# Altium schematic sheet CAN0.SchDoc: foxBMS BMS-Master
size A3; DocumentNumber: 14; SheetNumber: 14; SheetTotal: 24; Author: Fraunhofer IISB foxBMS Team; REL-DATE: 2017-05-16; VERSION: 1.0.6; SheetDescription: CAN0 Interface for MCU0; Rule: UNIONINDEX=0|RULEKIND=Clearance|NETSCOPE=DifferentNets|LAYERKIND=SameLayer|NAME=Schematic Clearance Constraint|GAP=10mil|GENERICCLEARANCE=10mil|IGNOREPADTOPADCLEARANCEINFOOTPRINT=FALSE|OBJECTCLEARANCES=ClearanceObj_Arc-ClearanceObj_Hole:0;ClearanceObj_Track-ClearanceObj_Hole:0;ClearanceObj_SMDPad-ClearanceObj_Hole:0;ClearanceObj_THPad-ClearanceObj_Hole:0;ClearanceObj_Via-ClearanceObj_Hole:0;ClearanceObj_Fill-ClearanceObj_Hole:0;ClearanceObj_Poly-ClearanceObj_Hole:0;ClearanceObj_Region-ClearanceObj_Hole:0;ClearanceObj_Text-ClearanceObj_Hole:0|UNIT=Metric
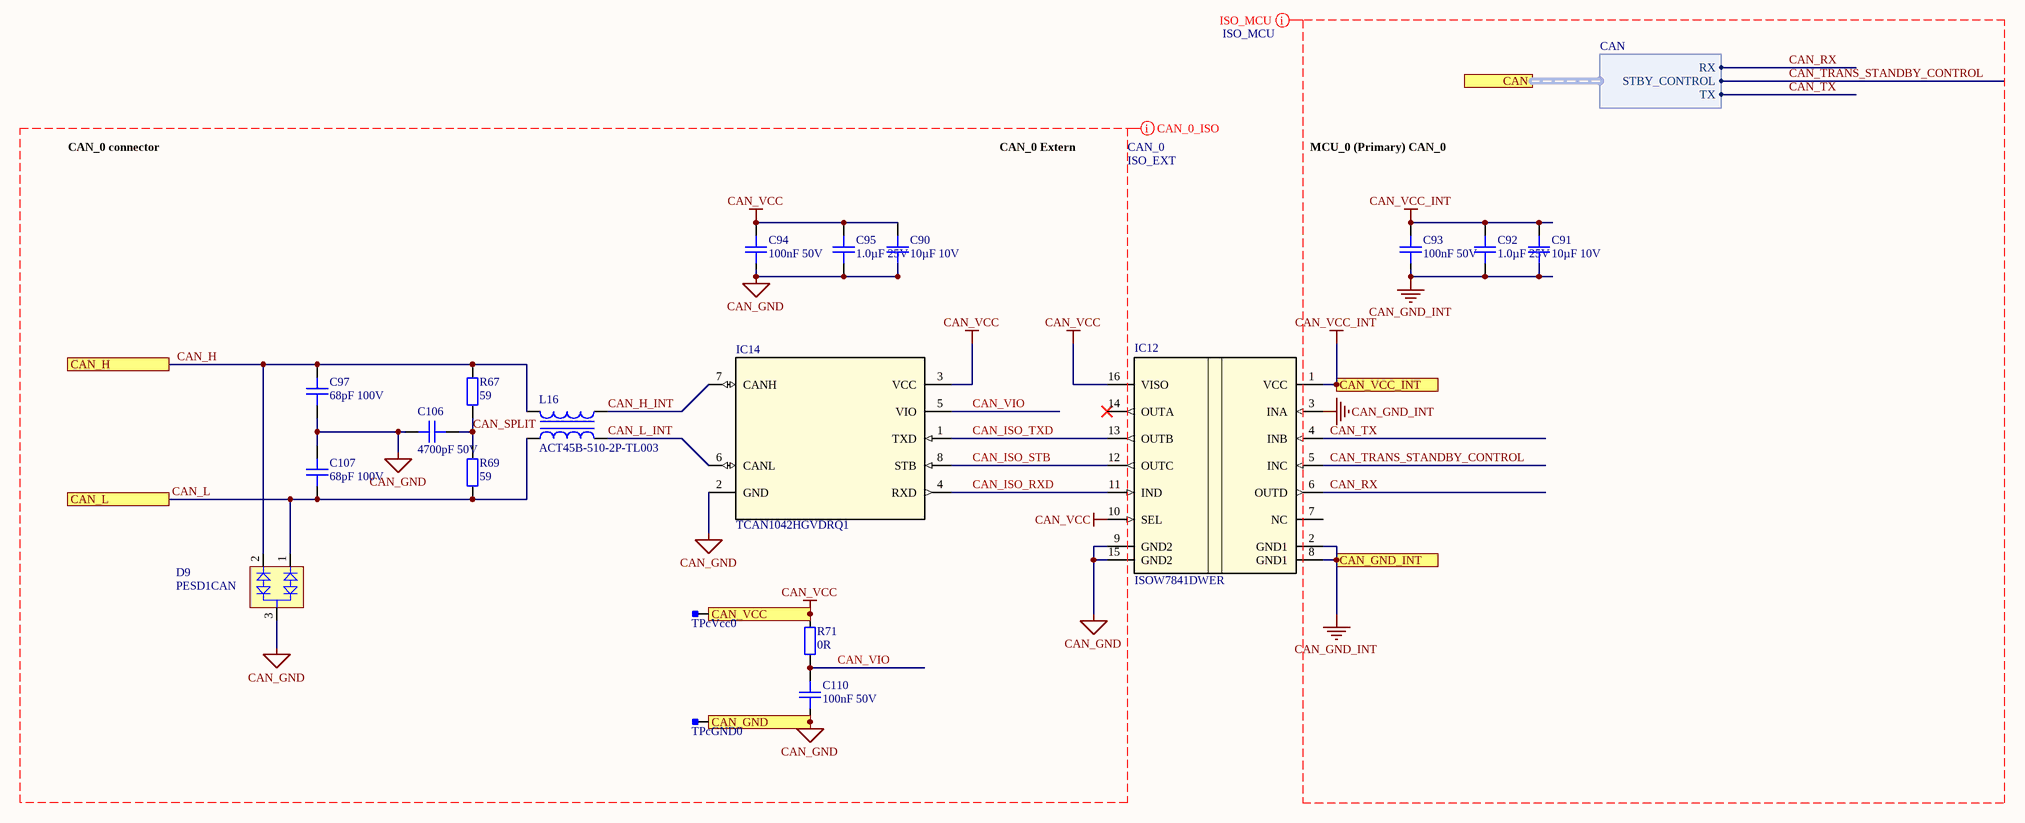
[diagram p0: CAN0.SchDoc]

## Parts
C90  10µF 10V  [0805C]
C91  10µF 10V  [0805C]
C92  1.0µF 25V  [0603C]
C93  100nF 50V  [0603C]
C94  100nF 50V  [0603C]
C95  1.0µF 25V  [0603C]
C97  68pF 100V  [0603C]
C106  4700pF 50V  [0603C]
C107  68pF 100V  [0603C]
C110  100nF 50V  [0603C]
D9  PESD1CAN  [NXP-SOT23-3_V]
IC12  ISOW7841DWER  [DWE0016A]
IC14  TCAN1042HGVDRQ1  [D0008A_N]
L16  ACT45B-510-2P-TL003  [TDK-ACT45B-510-2P-TL003-4_V]
R67  59  [0805R]
R69  59  [0805R]
R71  0R  [0603R]
TPcGND0  Testpoint_Square  [Testpoint_S1]  (value not drawn)  (no BOM)
TPcVcc0  Testpoint_Square  [Testpoint_S1]  (value not drawn)  (no BOM)

## Ports
CAN (harness CAN), CAN_GND, CAN_GND_INT, CAN_H, CAN_L, CAN_VCC, CAN_VCC_INT

## Harnesses
CAN: RX, STBY_CONTROL, TX

## Nets
CAN_GND: C90.2 C94.1 C95.1 C97.1 C106.1 C107.2 C110.1 D9.3(C) IC12.9(GND2) IC12.15(GND2) IC14.2(GND) TPcGND0.1 ; port CAN_GND
CAN_GND_INT: C91.2 C92.1 C93.1 IC12.2(GND1) IC12.3(INA) IC12.8(GND1) ; port CAN_GND_INT
CAN_VCC: C90.1 C94.2 C95.2 IC12.10(SEL) IC12.16(VISO) IC14.3(VCC) R71.1 TPcVcc0.1 ; port CAN_VCC
CAN_VCC_INT: C91.1 C92.2 C93.2 IC12.1(VCC) ; port CAN_VCC_INT
CAN_H: C97.2 D9.2(K2) L16.2 R67.2 ; port CAN_H
CAN_H_INT: IC14.7(CANH) L16.3
CAN_ISO_RXD: IC12.11(IND) IC14.4(RXD)
CAN_ISO_STB: IC12.12(OUTC) IC14.8(STB)
CAN_ISO_TXD: IC12.13(OUTB) IC14.1(TXD)
CAN_L: C107.1 D9.1(K1) L16.1 R69.1 ; port CAN_L
CAN_L_INT: IC14.6(CANL) L16.4
CAN_RX: IC12.6(OUTD) ; port CAN.RX
CAN_SPLIT: C106.2 R67.1 R69.2
CAN_TRANS_STANDBY_CONTROL: IC12.5(INC) ; port CAN.STBY_CONTROL
CAN_TX: IC12.4(INB) ; port CAN.TX
CAN_VIO: C110.2 IC14.5(VIO) R71.2

Not connected (* = marked no-connect by the designer): IC12 7(NC) 14(OUTA)*

## Layout directives
net class CAN_0; net class ISO_EXT: CAN_GND, CAN_H, CAN_H_INT, CAN_ISO_RXD, CAN_ISO_STB, CAN_ISO_TXD, CAN_L, CAN_L_INT, CAN_SPLIT, CAN_VCC, CAN_VIO
net class ISO_MCU: CAN_GND_INT, CAN_RX, CAN_TRANS_STANDBY_CONTROL, CAN_TX, CAN_VCC_INT

## Notes on the sheet
- CAN_0 connector
- CAN_0 Extern
- MCU_0 (Primary) CAN_0
- Fraunhofer IISB
- Schottkystr. 10
- developed by:
- 91058 Erlangen
- Germany
- Author
- Project
- License
- Description
- File
- Version
- Release Date
- Sheet
- www.foxbms.org
- www.iisb.fraunhofer.de
- foxBMS Team
- /

## Library data of the parts
C90 C91 = gen_C_ceramic_10u_10V_X7R_0805: Ceramic, 10µF, ±10%, 10V, X7R, –55 to 125°C, 0805 (2012),RoHS, Automotive; Part Number: GCJ21BR71A106KE01; Manufacturer: Murata; Case EIA: 0805; Case Metric: 2012; Automotive Qualified: True; PnP Package: C_0805_10; PnP Value: 10µF/10V/X7R; Capacitance: 10µF; Rated Voltage: 10V; Dielectric: X7R; Supplier 1: Digi-Key; Supplier Part Number 1: 490-12646-1-ND; Height - Seated (Max): 1.25mm; Mounting Type: SurfaceMount,MLCC; Operating Temperature: –55 to 125°C; Series: GCJ; Tolerance: ±10%; Manufacturer_Part_Number: GCJ21BR71A106KE01
C92 C95 = gen_C_ceramic_1u_25V_X7R_0603: Ceramic, 1.0µF, ±10%, 25V, X7R, –55 to 125°C, 0603 (1608),RoHS, Automotive; Part Number: GCJ188R71E105KA01; Manufacturer: Murata; Capacitance: 1µF; Case EIA: 0603; Case Metric: 1608; PnP Package: C_0603_10; PnP Value: 1.0µF/25V/X7R; Automotive Qualified: True; Rated Voltage: 25V; Dielectric: X7R; Supplier 1: Digi-Key; Supplier Part Number 1: 490-14409-1-ND; Height - Seated (Max): 0.8mm; Mounting Type: SurfaceMount,MLCC; Operating Temperature: –55 to 125°C; Series: GCJ; Tolerance: ±10%; Manufacturer_Part_Number: GCJ188R71E105KA01
C93 C94 C110 = gen_C_ceramic_100n_50V_X7R_0603: Ceramic, 100nF, ±10%, 50V, X7R, –55 to 125°C, 0603 (1608),RoHS, Automotive; Part Number: GCJ188R71H104KA12; Manufacturer: Murata; Capacitance: 100n; Case EIA: 0603; Case Metric: 1608; PnP Package: C_0603_10; PnP Value: 100nF/50V/X7R; PnP equipped: x; Automotive Qualified: True; Rated Voltage: 50V; Dielectric: X7R; Supplier 1: Digi-Key; Supplier Part Number 1: 490-5798-1-ND; Height - Seated (Max): 0.8mm; Mounting Type: SurfaceMount,MLCC; Operating Temperature: –55 to 125°C; Series: GCJ; Tolerance: ±10%; Manufacturer_Part_Number: GCJ188R71H104KA12
C97 C107 = gen_C_ceramic_68p_100V_X7R_0603: Ceramic, 68pF, ±5%, 100V, X7R, 25 to 125°C, 0603 (1608),RoHS, Automotive; Part Number: GCM1885C2A680JA16; Manufacturer: Murata; Capacitance: 68p; Case EIA: 0603; Case Metric: 1608; PnP Package: C_0603_05; Automotive Qualified: True; PnP Value: 68pF/100V/X7R; Rated Voltage: 100V; Dielectric: X7R; Supplier 1: Digi-Key; Supplier Part Number 1: 490-4945-1-ND; Height - Seated (Max): 0.8mm; Mounting Type: SurfaceMount,MLCC; Operating Temperature: 25 to 125°C; Series: GCM; Tolerance: ±5%; Manufacturer_Part_Number: GCM1885C2A680JA16
C106 = gen_C_ceramic_4n7_50V_X7R_0603: Ceramic, 4700pF, 0603, ±5%, 50V, C0G; Part Number: GRT1885C1H472JA02; Capacitance: 4700p; Case EIA: 0603; Case Metric: 1608; PnP Package: C_0603_05; Automotive Qualified: True; PnP Value: 4700pF/50V/C0G; Rated Voltage: 50V; Dielectric: C0G
D9 = CMP-2000-04916-1: CAN Bus ESD Protection Diode, 200 W, 24 V, -65 to 150 degC, 3-Pin SOT23, RoHS, Tape and Reel; Manufacturer: NXP Semiconductors; SVHC: NoSVHC(20-Jun-2013); Reverse Stand-Off Voltage Vrwm: 24V; Breakdown Voltage Max: 30.3V; Capacitance Cd @ Vr Typ: 11pF; TVS Polarity: Bidirectional; Peak Pulse Power: 200W; Breakdown Voltage Min: 25.4V; Clamping Voltage @ 8/20µs Max: 70V; Peak Pulse Current Ippm: 3A; SMD Marking: AN; Diode Case Style: SOT-23; Breakdown Voltage: 27.8V; Breakdown Voltage Range: 25.4Vto30.3V; Capacitance Cd @ Vr Max: 17pF; No. of Pins: 3; Diode Type: BidirectionalTVS; Termination Type: SMD; Operating Temperature Max: 150degC; Datasheet URL: https://datasheet.ciiva.com/22692/109497-22692467.pdf; Package / Case: SOT-23; Diode Configuration: Bidirectional; Operating Temperature Min: -65degC; Stand-off Voltage: 24V; Datasheet Version: Rev. 04, 02/2008; Manufacturer URL: http://www.nxp.com/; Operating Temperature Range: -65degCto+150degC; Breakover Voltage Min: 25.4V; Clamping Voltage Vc Max: 70V
IC12 = ISOW7841DWER: Imported; Manufacturer: Texas Instruments; PartNumber: ISOW7841DWER; RefDes: RefDes; TYPE: TYPE; Value: Value; Part Number: ISOW7841DWER
IC14 = TCAN1042HGVDRQ1: Imported; PartNumber: TCAN1042HGVDQ1; Manufacturer: Texas Instruments; RefDes: RefDes; TYPE: TYPE; Value: Value; Part Number: TCAN1042HGVDRQ1
L16 = CMP-2000-05391-1: Common-Mode Choke for CAN Bus System, 51uH, 50 V DC, -40 to 150 degC, 4-Pin SMD, RoHS, Tape and Reel; Manufacturer: TDK; Number of Lines: 2; Impedance: 2.8kOhm; Current: 200mA; Featured Product: FerriteChipCommon-ModeFilterforCAN-BUSSystem; Inductance: 51µH; Other Names: 445-3958-6; Filter Type: Data,SignalLine; DC Resistance (DCR): 1OhmMax; Dynamic Catalog: ACTSeries; Other Drawings: ACM3225SeriesSchematic / ACT45B-xxx-2P_Footprint; Catalog Drawings: (ACM4532,ACT45B)-xxx-2P_Top / ACT45B-xxx-2P_Side / ACT45B-xxx-2P_Bottom; Package / Case: Horizontal,4PCPad; Family: CommonModeChokes; Datasheet Version: Aug-12; Packaging: Digi-Reel; Category: Filters; Datasheet URL: https://datasheet.ciiva.com/22726/1649098-22726290.pdf; Mounting Type: SurfaceMount; Operating Temperature: -40degC~150degC; Series: ACT; Manufacturer URL: http://www.tdk.com/; Standard Package: 1; Part Number: ACT45B-510-2P-TL003
R67 R69 = gen_R_59R_0805: SMD Resistor 59R 0805; Part Number: gen_R_62R_0603; Tolerance: 1%; Power: 0.1W; Case EIA: 0805; Case Metric: 2012; Maximum Working Voltage: 75V; PnP Package: R_0603; Automotive Qualified: False; Operating Temperature: -55°C - +155°C; Resistance: 59; Series: E24; PnP Value: 59; Supplier 1: Farnell; Supplier Part Number 1: 2073943
R71 = gen_R_0R_0603: SMD Resistor 0R 0603; Power: 0.1W; Case EIA: 0603; Case Metric: 1608; Maximum Working Voltage: 75V; PnP Package: R_0603; Automotive Qualified: False; Part Number: gen_R_0R_0603; Operating Temperature: -55°C - +155°C; Resistance: 0R; Series: Jumper; PnP Value: 0R; Supplier 1: Farnell; Supplier Part Number 1: 2073345
TPcGND0 TPcVcc0 = Testpoint_Square: Testpoint, square; Part Number: Testpoint_Square